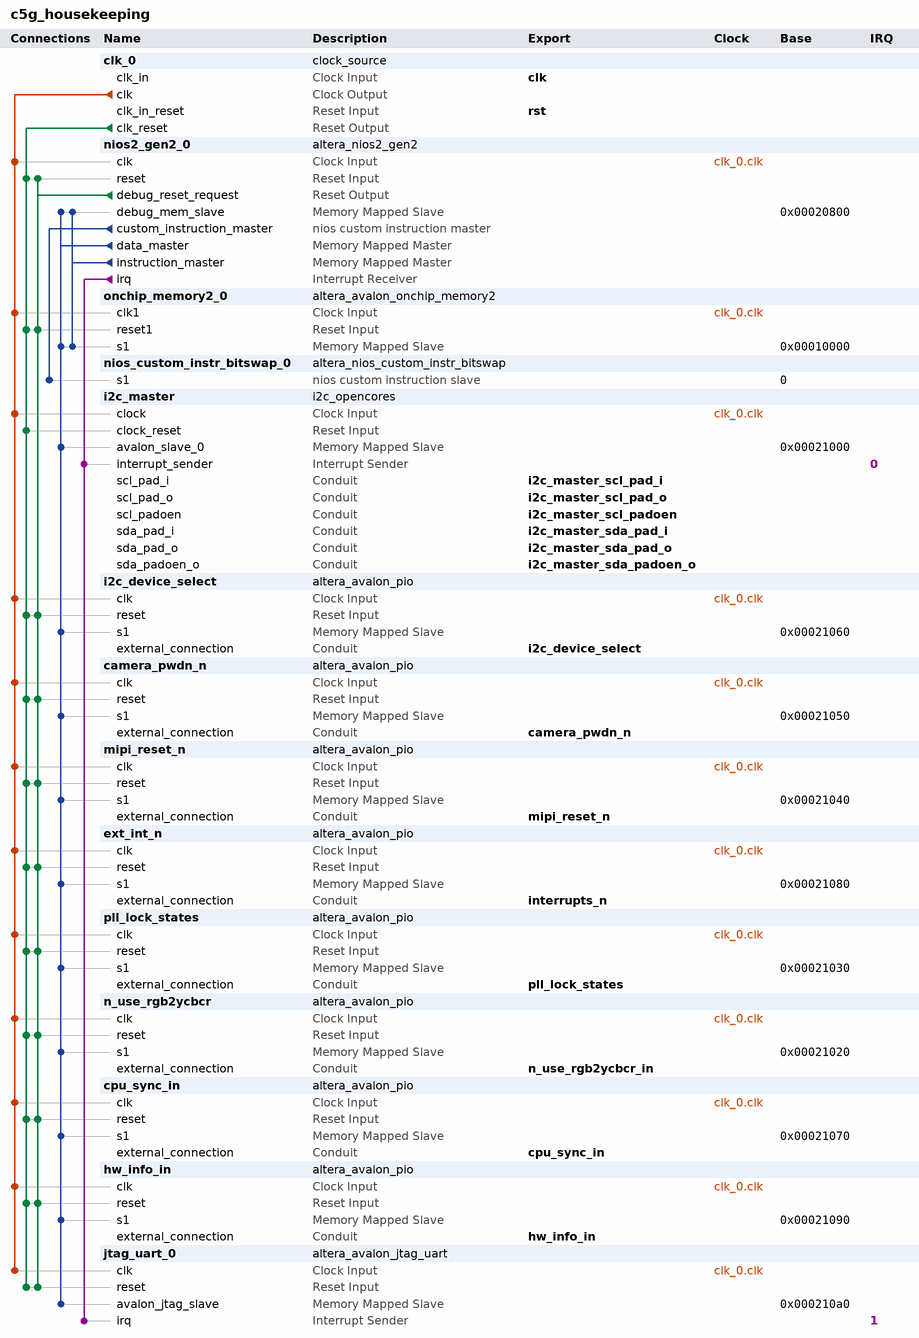
[diagram p0: system contents]
# Platform Designer (Qsys) system c5g_housekeeping, Cyclone V 5CGXFC5C6F27C7
# Parameters at their usual value, and those the tool derives, are not listed.
package require -exact qsys 22.1
create_system c5g_housekeeping
set_project_property DEVICE_FAMILY {Cyclone V}
set_project_property DEVICE 5CGXFC5C6F27C7

add_instance clk_0 clock_source 22.1
set_instance_parameter_value clk_0 clockFrequency 50000000
set_instance_parameter_value clk_0 resetSynchronousEdges BOTH

add_instance nios2_gen2_0 altera_nios2_gen2 22.1
set_instance_parameter_value nios2_gen2_0 dcache_size 2048
set_instance_parameter_value nios2_gen2_0 exceptionSlave onchip_memory2_0.s1
set_instance_parameter_value nios2_gen2_0 icache_size 4096
set_instance_parameter_value nios2_gen2_0 impl Tiny
set_instance_parameter_value nios2_gen2_0 resetSlave onchip_memory2_0.s1

add_instance onchip_memory2_0 altera_avalon_onchip_memory2 22.1
set_instance_parameter_value onchip_memory2_0 dataWidth 32
set_instance_parameter_value onchip_memory2_0 dualPort false
set_instance_parameter_value onchip_memory2_0 initMemContent true
set_instance_parameter_value onchip_memory2_0 initializationFileName ../nios/software/c5g_controller_app/mem_init/system_onchip_memory2_0.hex
set_instance_parameter_value onchip_memory2_0 memorySize 40960
set_instance_parameter_value onchip_memory2_0 useNonDefaultInitFile true

add_instance nios_custom_instr_bitswap_0 altera_nios_custom_instr_bitswap 22.1

add_instance i2c_master i2c_opencores 22.1

add_instance i2c_device_select altera_avalon_pio 22.1
set_instance_parameter_value i2c_device_select direction Output
set_instance_parameter_value i2c_device_select width 2

add_instance camera_pwdn_n altera_avalon_pio 22.1
set_instance_parameter_value camera_pwdn_n direction Output
set_instance_parameter_value camera_pwdn_n width 1

add_instance mipi_reset_n altera_avalon_pio 22.1
set_instance_parameter_value mipi_reset_n direction Output
set_instance_parameter_value mipi_reset_n width 1

add_instance ext_int_n altera_avalon_pio 22.1
set_instance_parameter_value ext_int_n direction Input
set_instance_parameter_value ext_int_n width 1

add_instance pll_lock_states altera_avalon_pio 22.1
set_instance_parameter_value pll_lock_states direction Input
set_instance_parameter_value pll_lock_states width 1

add_instance n_use_rgb2ycbcr altera_avalon_pio 22.1
set_instance_parameter_value n_use_rgb2ycbcr direction Input
set_instance_parameter_value n_use_rgb2ycbcr width 1

add_instance cpu_sync_in altera_avalon_pio 22.1
set_instance_parameter_value cpu_sync_in direction Input
set_instance_parameter_value cpu_sync_in width 1

add_instance hw_info_in altera_avalon_pio 22.1
set_instance_parameter_value hw_info_in direction Input
set_instance_parameter_value hw_info_in width 16

add_instance jtag_uart_0 altera_avalon_jtag_uart 22.1
set_instance_parameter_value jtag_uart_0 simInteractiveOptions NO_INTERACTIVE_WINDOWS
set_instance_parameter_value jtag_uart_0 useRegistersForReadBuffer true

# connections
add_connection clk_0.clk camera_pwdn_n.clk clock
add_connection clk_0.clk cpu_sync_in.clk clock
add_connection clk_0.clk ext_int_n.clk clock
add_connection clk_0.clk hw_info_in.clk clock
add_connection clk_0.clk i2c_device_select.clk clock
add_connection clk_0.clk i2c_master.clock clock
add_connection clk_0.clk jtag_uart_0.clk clock
add_connection clk_0.clk mipi_reset_n.clk clock
add_connection clk_0.clk n_use_rgb2ycbcr.clk clock
add_connection clk_0.clk nios2_gen2_0.clk clock
add_connection clk_0.clk onchip_memory2_0.clk1 clock
add_connection clk_0.clk pll_lock_states.clk clock
add_connection clk_0.clk_reset camera_pwdn_n.reset reset
add_connection clk_0.clk_reset cpu_sync_in.reset reset
add_connection clk_0.clk_reset ext_int_n.reset reset
add_connection clk_0.clk_reset hw_info_in.reset reset
add_connection clk_0.clk_reset i2c_device_select.reset reset
add_connection clk_0.clk_reset i2c_master.clock_reset reset
add_connection clk_0.clk_reset jtag_uart_0.reset reset
add_connection clk_0.clk_reset mipi_reset_n.reset reset
add_connection clk_0.clk_reset n_use_rgb2ycbcr.reset reset
add_connection clk_0.clk_reset nios2_gen2_0.reset reset
add_connection clk_0.clk_reset onchip_memory2_0.reset1 reset
add_connection clk_0.clk_reset pll_lock_states.reset reset
add_connection nios2_gen2_0.debug_reset_request camera_pwdn_n.reset reset
add_connection nios2_gen2_0.debug_reset_request cpu_sync_in.reset reset
add_connection nios2_gen2_0.debug_reset_request ext_int_n.reset reset
add_connection nios2_gen2_0.debug_reset_request hw_info_in.reset reset
add_connection nios2_gen2_0.debug_reset_request i2c_device_select.reset reset
add_connection nios2_gen2_0.debug_reset_request jtag_uart_0.reset reset
add_connection nios2_gen2_0.debug_reset_request mipi_reset_n.reset reset
add_connection nios2_gen2_0.debug_reset_request n_use_rgb2ycbcr.reset reset
add_connection nios2_gen2_0.debug_reset_request nios2_gen2_0.reset reset
add_connection nios2_gen2_0.debug_reset_request onchip_memory2_0.reset1 reset
add_connection nios2_gen2_0.debug_reset_request pll_lock_states.reset reset
add_connection nios2_gen2_0.data_master camera_pwdn_n.s1 avalon
set_connection_parameter_value nios2_gen2_0.data_master/camera_pwdn_n.s1 baseAddress 0x00021050
add_connection nios2_gen2_0.data_master cpu_sync_in.s1 avalon
set_connection_parameter_value nios2_gen2_0.data_master/cpu_sync_in.s1 baseAddress 0x00021070
add_connection nios2_gen2_0.data_master ext_int_n.s1 avalon
set_connection_parameter_value nios2_gen2_0.data_master/ext_int_n.s1 baseAddress 0x00021080
add_connection nios2_gen2_0.data_master hw_info_in.s1 avalon
set_connection_parameter_value nios2_gen2_0.data_master/hw_info_in.s1 baseAddress 0x00021090
add_connection nios2_gen2_0.data_master i2c_device_select.s1 avalon
set_connection_parameter_value nios2_gen2_0.data_master/i2c_device_select.s1 baseAddress 0x00021060
add_connection nios2_gen2_0.data_master i2c_master.avalon_slave_0 avalon
set_connection_parameter_value nios2_gen2_0.data_master/i2c_master.avalon_slave_0 baseAddress 0x00021000
add_connection nios2_gen2_0.data_master jtag_uart_0.avalon_jtag_slave avalon
set_connection_parameter_value nios2_gen2_0.data_master/jtag_uart_0.avalon_jtag_slave baseAddress 0x000210a0
add_connection nios2_gen2_0.data_master mipi_reset_n.s1 avalon
set_connection_parameter_value nios2_gen2_0.data_master/mipi_reset_n.s1 baseAddress 0x00021040
add_connection nios2_gen2_0.data_master n_use_rgb2ycbcr.s1 avalon
set_connection_parameter_value nios2_gen2_0.data_master/n_use_rgb2ycbcr.s1 baseAddress 0x00021020
add_connection nios2_gen2_0.data_master nios2_gen2_0.debug_mem_slave avalon
set_connection_parameter_value nios2_gen2_0.data_master/nios2_gen2_0.debug_mem_slave baseAddress 0x00020800
add_connection nios2_gen2_0.data_master onchip_memory2_0.s1 avalon
set_connection_parameter_value nios2_gen2_0.data_master/onchip_memory2_0.s1 baseAddress 0x00010000
add_connection nios2_gen2_0.data_master pll_lock_states.s1 avalon
set_connection_parameter_value nios2_gen2_0.data_master/pll_lock_states.s1 baseAddress 0x00021030
add_connection nios2_gen2_0.instruction_master nios2_gen2_0.debug_mem_slave avalon
set_connection_parameter_value nios2_gen2_0.instruction_master/nios2_gen2_0.debug_mem_slave baseAddress 0x00020800
add_connection nios2_gen2_0.instruction_master onchip_memory2_0.s1 avalon
set_connection_parameter_value nios2_gen2_0.instruction_master/onchip_memory2_0.s1 baseAddress 0x00010000
add_connection nios2_gen2_0.irq i2c_master.interrupt_sender interrupt
set_connection_parameter_value nios2_gen2_0.irq/i2c_master.interrupt_sender irqNumber 0
add_connection nios2_gen2_0.irq jtag_uart_0.irq interrupt
set_connection_parameter_value nios2_gen2_0.irq/jtag_uart_0.irq irqNumber 1
add_connection nios2_gen2_0.custom_instruction_master nios_custom_instr_bitswap_0.s1 nios_custom_instruction
set_connection_parameter_value nios2_gen2_0.custom_instruction_master/nios_custom_instr_bitswap_0.s1 CIName nios_custom_instr_bitswap_0
set_connection_parameter_value nios2_gen2_0.custom_instruction_master/nios_custom_instr_bitswap_0.s1 baseAddress 0

# exported interfaces
add_interface camera_pwdn_n conduit end
set_interface_property camera_pwdn_n EXPORT_OF camera_pwdn_n.external_connection
add_interface clk clock sink
set_interface_property clk EXPORT_OF clk_0.clk_in
add_interface cpu_sync_in conduit end
set_interface_property cpu_sync_in EXPORT_OF cpu_sync_in.external_connection
add_interface hw_info_in conduit end
set_interface_property hw_info_in EXPORT_OF hw_info_in.external_connection
add_interface i2c_device_select conduit end
set_interface_property i2c_device_select EXPORT_OF i2c_device_select.external_connection
add_interface i2c_master_scl_pad_i conduit end
set_interface_property i2c_master_scl_pad_i EXPORT_OF i2c_master.scl_pad_i
add_interface i2c_master_scl_pad_o conduit end
set_interface_property i2c_master_scl_pad_o EXPORT_OF i2c_master.scl_pad_o
add_interface i2c_master_scl_padoen conduit end
set_interface_property i2c_master_scl_padoen EXPORT_OF i2c_master.scl_padoen
add_interface i2c_master_sda_pad_i conduit end
set_interface_property i2c_master_sda_pad_i EXPORT_OF i2c_master.sda_pad_i
add_interface i2c_master_sda_pad_o conduit end
set_interface_property i2c_master_sda_pad_o EXPORT_OF i2c_master.sda_pad_o
add_interface i2c_master_sda_padoen_o conduit end
set_interface_property i2c_master_sda_padoen_o EXPORT_OF i2c_master.sda_padoen_o
add_interface interrupts_n conduit end
set_interface_property interrupts_n EXPORT_OF ext_int_n.external_connection
add_interface mipi_reset_n conduit end
set_interface_property mipi_reset_n EXPORT_OF mipi_reset_n.external_connection
add_interface n_use_rgb2ycbcr_in conduit end
set_interface_property n_use_rgb2ycbcr_in EXPORT_OF n_use_rgb2ycbcr.external_connection
add_interface pll_lock_states conduit end
set_interface_property pll_lock_states EXPORT_OF pll_lock_states.external_connection
add_interface rst reset sink
set_interface_property rst EXPORT_OF clk_0.clk_in_reset

set_interconnect_requirement {$system} qsys_mm.clockCrossingAdapter HANDSHAKE
set_interconnect_requirement {$system} qsys_mm.enableEccProtection FALSE
set_interconnect_requirement {$system} qsys_mm.insertDefaultSlave FALSE
set_interconnect_requirement {$system} qsys_mm.maxAdditionalLatency 1

save_system c5g_housekeeping.qsys
